# Altium schematic sheet channel_45678.SchDoc
size A2; SheetNumber: 12; SheetTotal: 12
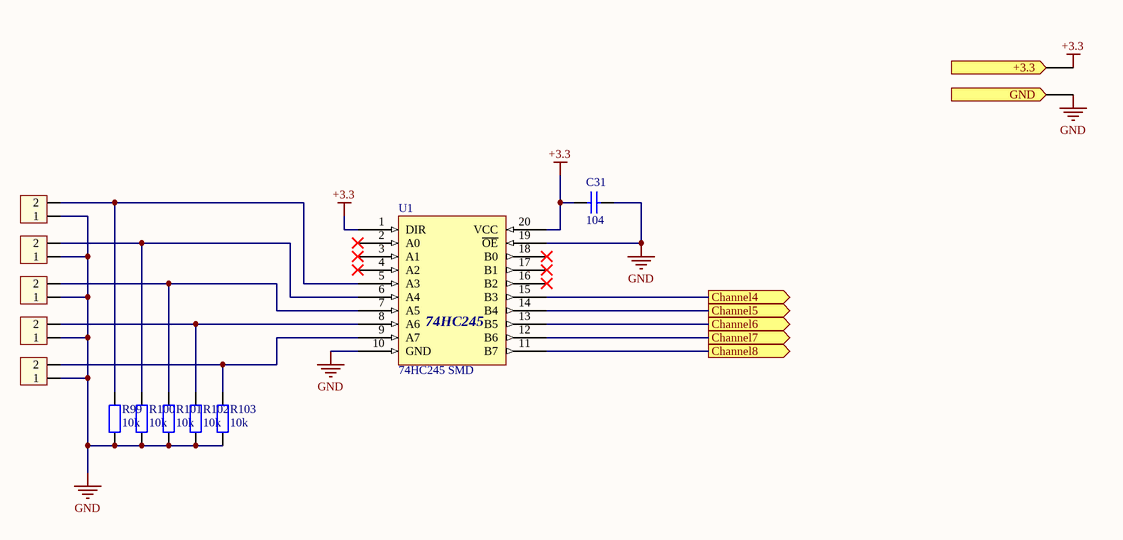
[diagram p0: channel_45678.SchDoc]

## Parts
C31  104  [tu 0603]
H4  Header 2P 2.54 Duc Thang  [15EDGR-3.81-2P]  (value not drawn)
H5  Header 2P 2.54 Duc Thang  [15EDGR-3.81-2P]  (value not drawn)
H6  Header 2P 2.54 Duc Thang  [15EDGR-3.81-2P]  (value not drawn)
H7  Header 2P 2.54 Duc Thang  [15EDGR-3.81-2P]  (value not drawn)
H8  Header 2P 2.54 Duc Thang  [15EDGR-3.81-2P]  (value not drawn)
R99  10k  [tro smd 0603]
R100  10k  [tro smd 0603]
R101  10k  [tro smd 0603]
R102  10k  [tro smd 0603]
R103  10k  [tro smd 0603]
U1  74HC245 SMD  [SOP 20]

## Ports
+3.3 (in), Channel4 (out), Channel5 (out), Channel6 (out), Channel7 (out), Channel8 (out), GND (in)

## Nets
+3.3: C31.2 U1.1(DIR) U1.20(VCC) ; port +3.3
GND: C31.1 H4.1 H5.1 H6.1 H7.1 H8.1 R99.1 R100.1 R101.1 R102.1 R103.1 U1.10(GND) U1.19(~{OE}) ; port GND
Channel4: U1.15(B3) ; port Channel4
Channel5: U1.14(B4) ; port Channel5
Channel6: U1.13(B5) ; port Channel6
Channel7: U1.12(B6) ; port Channel7
Channel8: U1.11(B7) ; port Channel8
NetH4_2: H4.2 R99.2 U1.5(A3)
NetH5_2: H5.2 R100.2 U1.6(A4)
NetH6_2: H6.2 R101.2 U1.7(A5)
NetH7_2: H7.2 R102.2 U1.8(A6)
NetH8_2: H8.2 R103.2 U1.9(A7)

Not connected (* = marked no-connect by the designer): U1 2(A0)* 3(A1)* 4(A2)* 16(B2)* 17(B1)* 18(B0)*

## Notes on the sheet
- (in symbol 74HC245 SMD) 74HC245

## Library data of the parts
C31 = Tu 0603 104 50V 10%: Dán; Don_Vi: Con; So_Chan: 2; Ten_Linh_Kien: Tụ 0603 104-100nF 10% 50V; Ma_Hang: MH004568; Chung_Loai: Dán; Kieu_Chan: *
H4-H8 = Header 2P 2.54 Duc Thang: Cắm; Ten_Linh_Kien: Header 2P XH2.54-2P Đực Thẳng; Don_Vi: Con; Ma_Hang: MH001283; Chung_Loai: Cắm
R99-R103 = Tro 0603 1% 10k: Dán; Don_Vi: Con; So_Chan: 2; Ten_Linh_Kien: Trở 0603 1% 10k; Ma_Hang: MH006333; Chung_Loai: Dán; Kieu_Chan: *
U1 = 74HC245 SMD: Dán; Ten_Linh_Kien: 74HC245DW SSOP20 5.2MM; Don_Vi: Con; Ma_Hang: MH003571; Ghi_Chu: *; Kieu_Chan: *; Chung_Loai: Dán